# EAGLE design New (EAGLE 8.6.0)
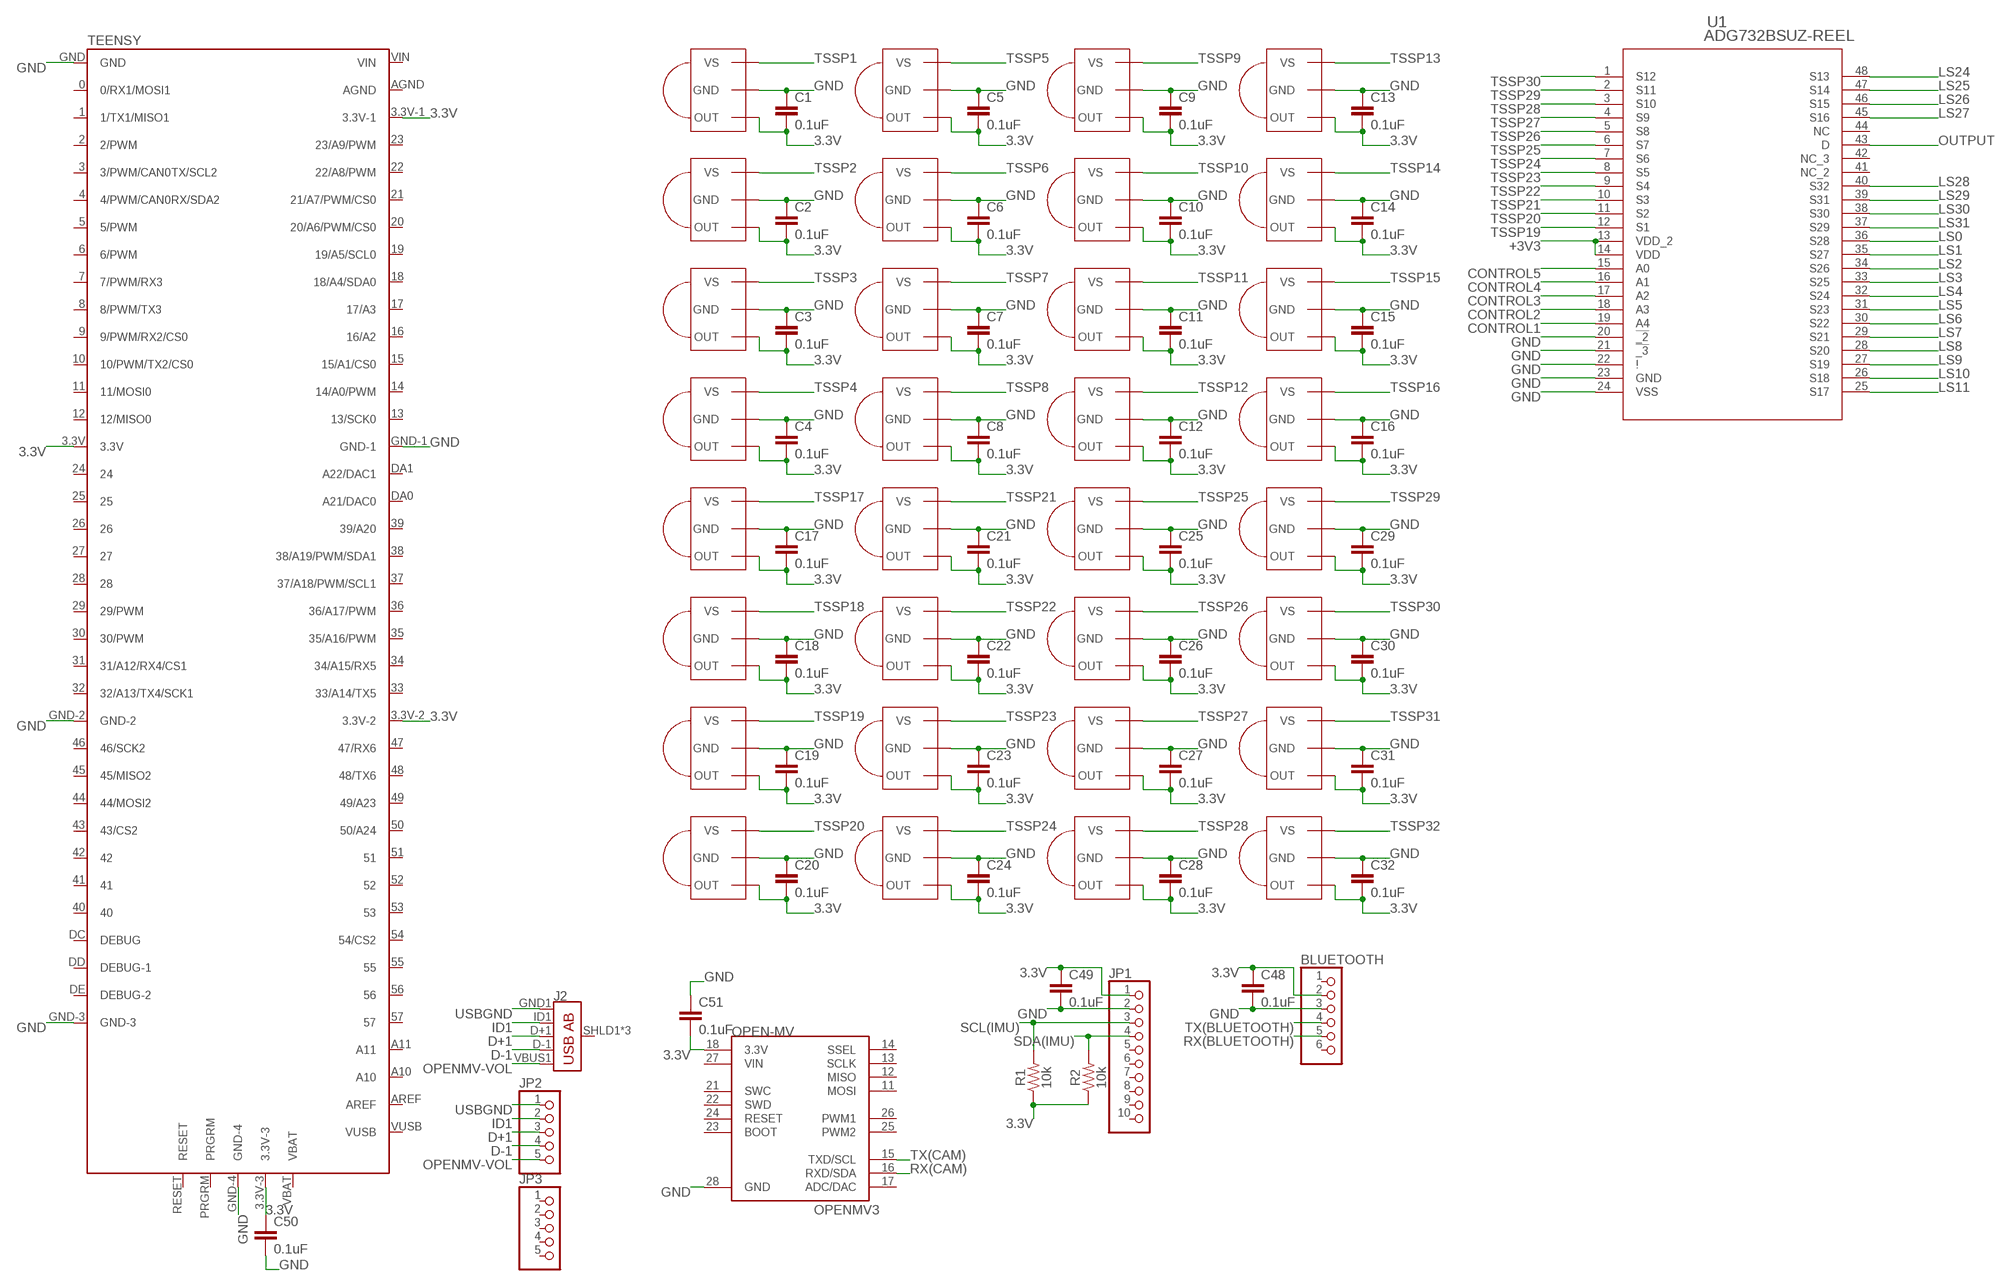
[diagram p0: schematic, sheet 1, part 1 of 2]
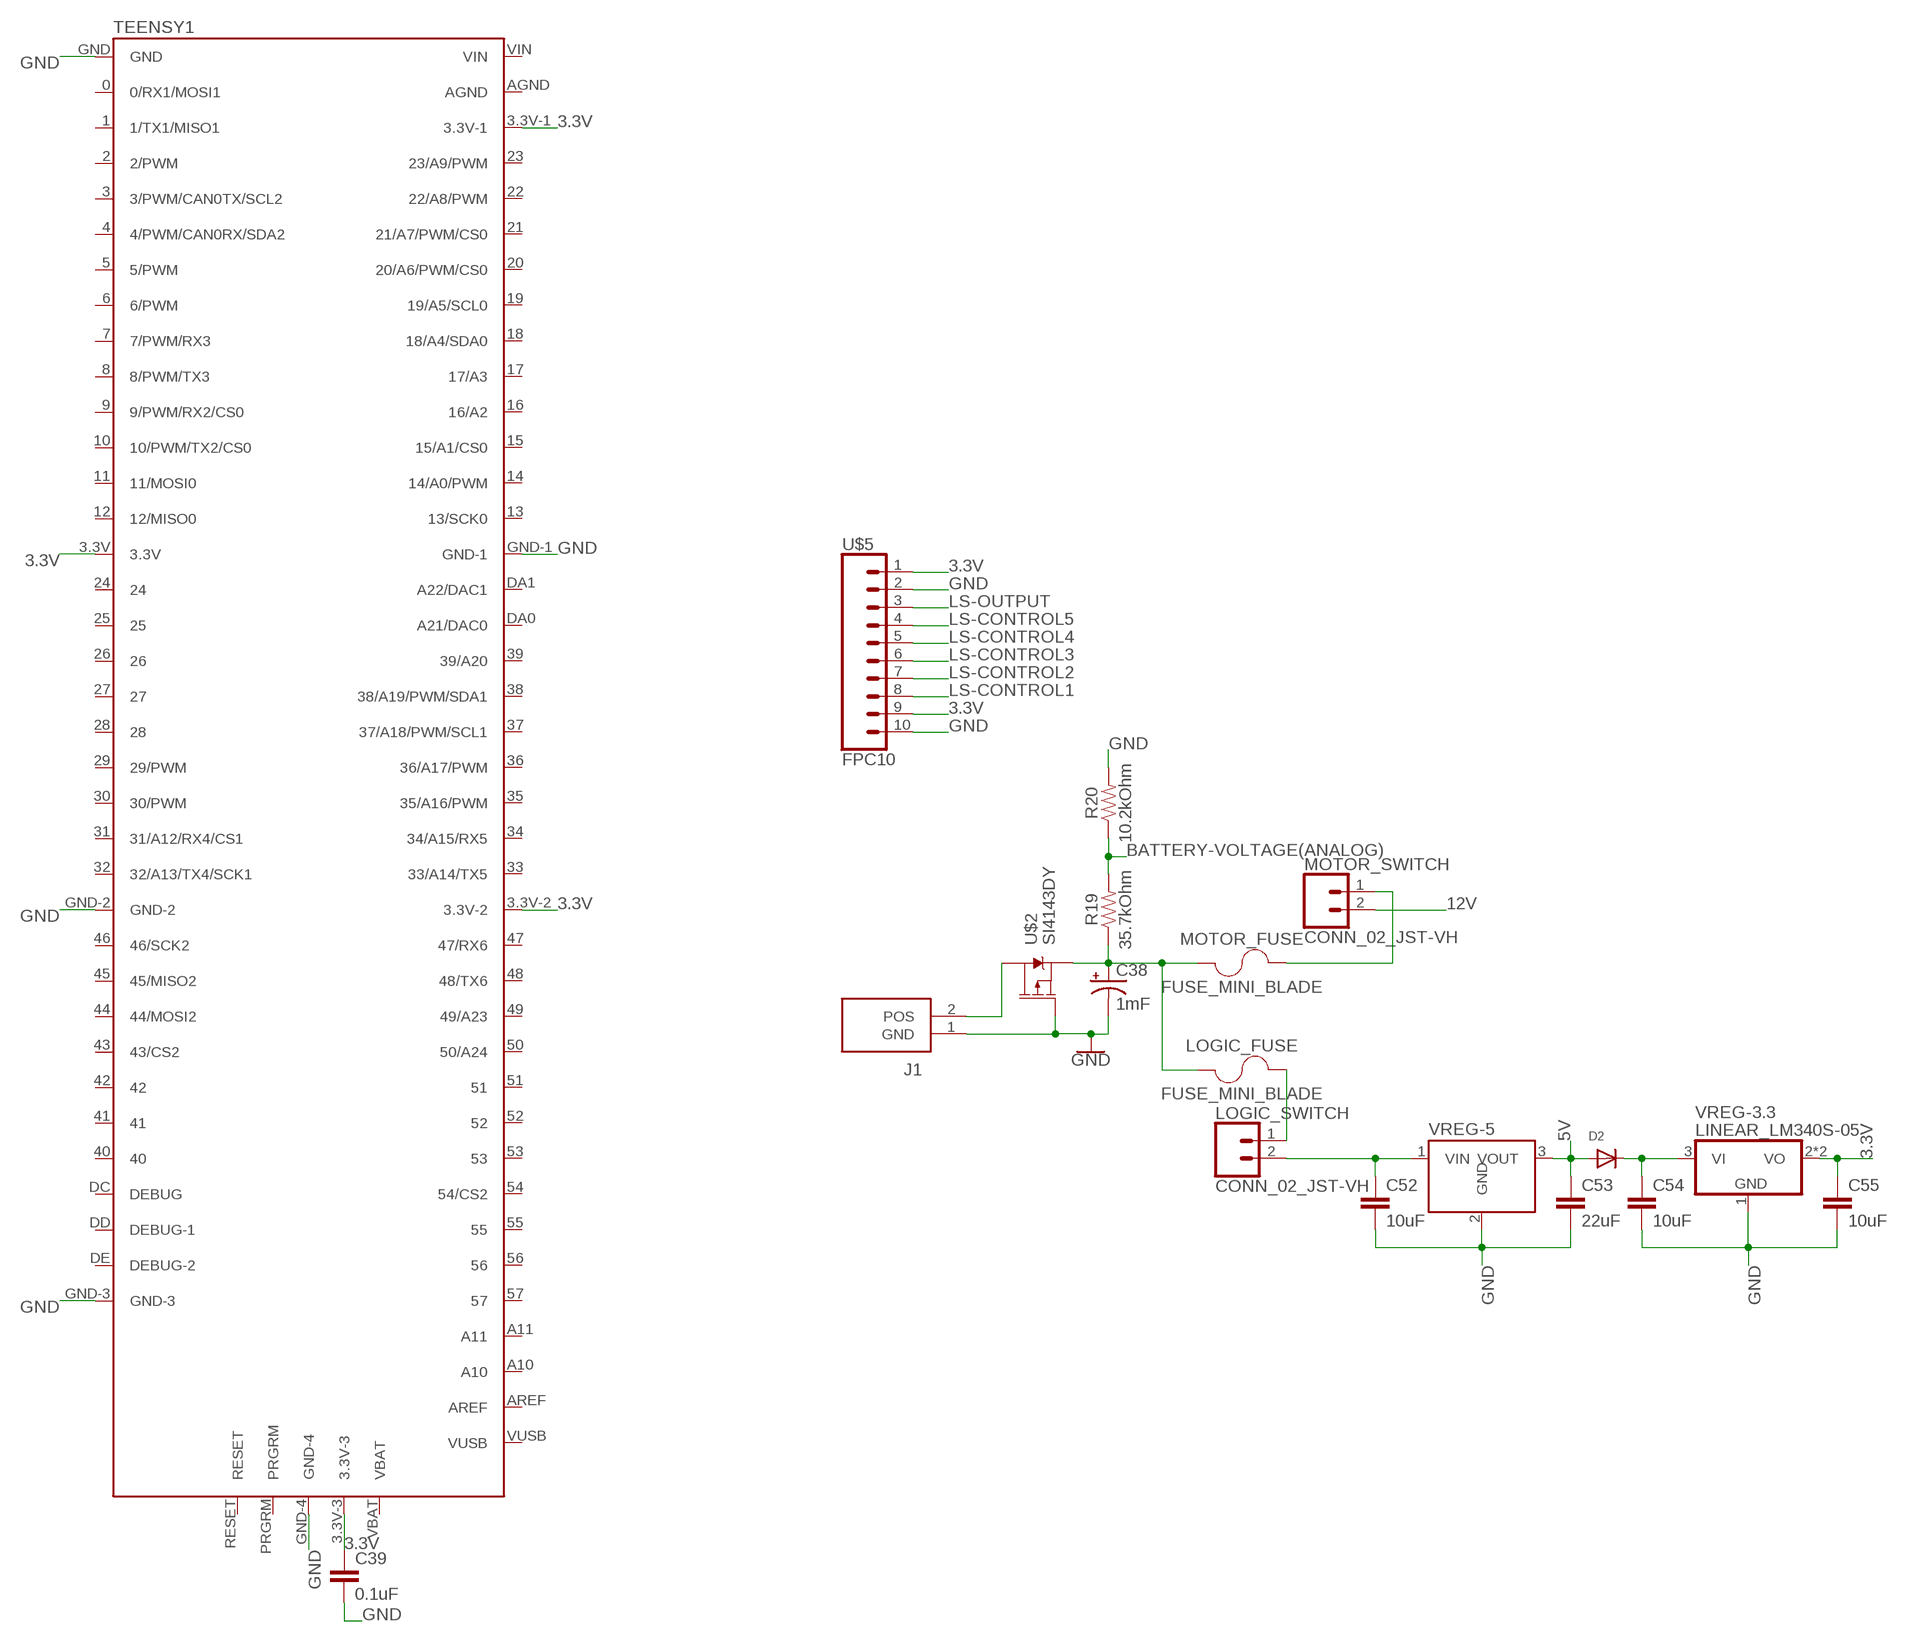
[diagram p1: schematic, sheet 1, part 2 of 2]

## Parts
BLUETOOTH  PINHD-1X6  [1X06]
C1  0.1uF  0.1UF-0603-25V-(+80/-20%)  [0603]
C2  0.1uF  0.1UF-0603-25V-(+80/-20%)  [0603]
C3  0.1uF  0.1UF-0603-25V-(+80/-20%)  [0603]
C4  0.1uF  0.1UF-0603-25V-(+80/-20%)  [0603]
C5  0.1uF  0.1UF-0603-25V-(+80/-20%)  [0603]
C6  0.1uF  0.1UF-0603-25V-(+80/-20%)  [0603]
C7  0.1uF  0.1UF-0603-25V-(+80/-20%)  [0603]
C8  0.1uF  0.1UF-0603-25V-(+80/-20%)  [0603]
C9  0.1uF  0.1UF-0603-25V-(+80/-20%)  [0603]
C10  0.1uF  0.1UF-0603-25V-(+80/-20%)  [0603]
C11  0.1uF  0.1UF-0603-25V-(+80/-20%)  [0603]
C12  0.1uF  0.1UF-0603-25V-(+80/-20%)  [0603]
C13  0.1uF  0.1UF-0603-25V-(+80/-20%)  [0603]
C14  0.1uF  0.1UF-0603-25V-(+80/-20%)  [0603]
C15  0.1uF  0.1UF-0603-25V-(+80/-20%)  [0603]
C16  0.1uF  0.1UF-0603-25V-(+80/-20%)  [0603]
C17  0.1uF  0.1UF-0603-25V-(+80/-20%)  [0603]
C18  0.1uF  0.1UF-0603-25V-(+80/-20%)  [0603]
C19  0.1uF  0.1UF-0603-25V-(+80/-20%)  [0603]
C20  0.1uF  0.1UF-0603-25V-(+80/-20%)  [0603]
C21  0.1uF  0.1UF-0603-25V-(+80/-20%)  [0603]
C22  0.1uF  0.1UF-0603-25V-(+80/-20%)  [0603]
C23  0.1uF  0.1UF-0603-25V-(+80/-20%)  [0603]
C24  0.1uF  0.1UF-0603-25V-(+80/-20%)  [0603]
C25  0.1uF  0.1UF-0603-25V-(+80/-20%)  [0603]
C26  0.1uF  0.1UF-0603-25V-(+80/-20%)  [0603]
C27  0.1uF  0.1UF-0603-25V-(+80/-20%)  [0603]
C28  0.1uF  0.1UF-0603-25V-(+80/-20%)  [0603]
C29  0.1uF  0.1UF-0603-25V-(+80/-20%)  [0603]
C30  0.1uF  0.1UF-0603-25V-(+80/-20%)  [0603]
C31  0.1uF  0.1UF-0603-25V-(+80/-20%)  [0603]
C32  0.1uF  0.1UF-0603-25V-(+80/-20%)  [0603]
C38  1mF  1000UF-RADIAL-5MM-25V-20%  [CPOL-RADIAL-5MM-10MM]
C39  0.1uF  0.1UF-0603-25V-(+80/-20%)  [0603]
C48  0.1uF  0.1UF-0603-25V-(+80/-20%)  [0603]
C49  0.1uF  0.1UF-0603-25V-(+80/-20%)  [0603]
C50  0.1uF  0.1UF-0603-25V-(+80/-20%)  [0603]
C51  0.1uF  0.1UF-0603-25V-(+80/-20%)  [0603]
C52  10uF  0805_CAPACITOR_SMD  [SPARKFUN-CAPACITORS_0805]
C53  22uF  1206_CAPACITOR_SMD  [SPARKFUN-CAPACITORS_1206]
C54  10uF  0805_CAPACITOR_SMD  [SPARKFUN-CAPACITORS_0805]
C55  10uF  0805_CAPACITOR_SMD  [SPARKFUN-CAPACITORS_0805]
D2  ADAFRUIT_DIODE_SOD-123FL:1  [ADAFRUIT_SOD-123FL]
J1  PRT-10474  [SHDR2W320P716_1X2_1574X813X158]
J2  USB_AB_SMT  [USB-AB-MICRO-SMD]
JP1  PINHD-1X10  [1X10]
JP2  PINHD-1X5  [1X05]
JP3  PINHD-1X5  [1X05]
LOGIC_FUSE  FUSE_MINI_BLADE  [SL-1538]
LOGIC_SWITCH  CONN_02_JST-VH  [B2P-VH@1]
MOTOR_FUSE  FUSE_MINI_BLADE  [SL-1538]
MOTOR_SWITCH  CONN_02_JST-VH  [B2P-VH@1]
OPEN-MV  OPENMV3  [OPENMV3]
R1  10k  10KOHM-0603-1/10W-1%  [0603]
R2  10k  10KOHM-0603-1/10W-1%  [0603]
R19  35.7kOhm  75KOHM-0603-1/10W-1%  [0603]
R20  10.2kOhm  75KOHM-0603-1/10W-1%  [0603]
TEENSY  TEENSY-3.5  [TEENSY-3.5]
TEENSY1  TEENSY-3.5  [TEENSY-3.5]
TSSP1  TSSP58038  [MINICAST]
TSSP2  TSSP58038  [MINICAST]
TSSP3  TSSP58038  [MINICAST]
TSSP4  TSSP58038  [MINICAST]
TSSP5  TSSP58038  [MINICAST]
TSSP6  TSSP58038  [MINICAST]
TSSP7  TSSP58038  [MINICAST]
TSSP8  TSSP58038  [MINICAST]
TSSP9  TSSP58038  [MINICAST]
TSSP10  TSSP58038  [MINICAST]
TSSP11  TSSP58038  [MINICAST]
TSSP12  TSSP58038  [MINICAST]
TSSP13  TSSP58038  [MINICAST]
TSSP14  TSSP58038  [MINICAST]
TSSP15  TSSP58038  [MINICAST]
TSSP16  TSSP58038  [MINICAST]
TSSP17  TSSP58038  [MINICAST]
TSSP18  TSSP58038  [MINICAST]
TSSP19  TSSP58038  [MINICAST]
TSSP20  TSSP58038  [MINICAST]
TSSP21  TSSP58038  [MINICAST]
TSSP22  TSSP58038  [MINICAST]
TSSP23  TSSP58038  [MINICAST]
TSSP24  TSSP58038  [MINICAST]
TSSP25  TSSP58038  [MINICAST]
TSSP26  TSSP58038  [MINICAST]
TSSP27  TSSP58038  [MINICAST]
TSSP28  TSSP58038  [MINICAST]
TSSP29  TSSP58038  [MINICAST]
TSSP30  TSSP58038  [MINICAST]
TSSP31  TSSP58038  [MINICAST]
TSSP32  TSSP58038  [MINICAST]
U1  ADG732BSUZ-REEL  [SU_48]
U$2  SI4143DY  [SO-8]
U$5  FPC10  [FPC10]
VREG-3.3  LINEAR_LM340S-05  [LINEAR_TO263-3]
VREG-5  V78-2000-SWITCHING-REGULATOR_V78-2000  [V78-2000-SWITCHING-REGULATOR_V78-2000]

## Nets
3.3V: BLUETOOTH.2 C1.2 C2.2 C3.2 C4.2 C5.2 C6.2 C7.2 C8.2 C9.2 C10.2 C11.2 C12.2 C13.2 C14.2 C15.2 C16.2 C17.2 C18.2 C19.2 C20.2 C21.2 C22.2 C23.2 C24.2 C25.2 C26.2 C27.2 C28.2 C29.2 C30.2 C31.2 C32.2 C39.1 C48.1 C49.1 C50.1 C51.2 C55.1 JP1.1 OPEN-MV.18(3.3V) R1.1 R2.1 TEENSY1.3.3V TEENSY1.3.3V-1 TEENSY1.3.3V-2 TEENSY1.3.3V-3 TEENSY.3.3V TEENSY.3.3V-1 TEENSY.3.3V-2 TEENSY.3.3V-3 TSSP1.1(OUT) TSSP2.1(OUT) TSSP3.1(OUT) TSSP4.1(OUT) TSSP5.1(OUT) TSSP6.1(OUT) TSSP7.1(OUT) TSSP8.1(OUT) TSSP9.1(OUT) TSSP10.1(OUT) TSSP11.1(OUT) TSSP12.1(OUT) TSSP13.1(OUT) TSSP14.1(OUT) TSSP15.1(OUT) TSSP16.1(OUT) TSSP17.1(OUT) TSSP18.1(OUT) TSSP19.1(OUT) TSSP20.1(OUT) TSSP21.1(OUT) TSSP22.1(OUT) TSSP23.1(OUT) TSSP24.1(OUT) TSSP25.1(OUT) TSSP26.1(OUT) TSSP27.1(OUT) TSSP28.1(OUT) TSSP29.1(OUT) TSSP30.1(OUT) TSSP31.1(OUT) TSSP32.1(OUT) U$5.1 U$5.9 VREG-3.3.2(VO) VREG-3.3.TAB(VO)
5V: C53.1 D2.A VREG-5.3(VOUT)
12V: MOTOR_SWITCH.2
+3V3: U1.13(VDD_2) U1.14(VDD)
BATTERY-VOLTAGE(ANALOG): R19.2 R20.1
CONTROL1: U1.19(A4)
CONTROL2: U1.18(A3)
CONTROL3: U1.17(A2)
CONTROL4: U1.16(A1)
CONTROL5: U1.15(A0)
D+1: J2.D+1(D+) JP2.3
D-1: J2.D-1(D-) JP2.4
GND: BLUETOOTH.3 C1.1 C2.1 C3.1 C4.1 C5.1 C6.1 C7.1 C8.1 C9.1 C10.1 C11.1 C12.1 C13.1 C14.1 C15.1 C16.1 C17.1 C18.1 C19.1 C20.1 C21.1 C22.1 C23.1 C24.1 C25.1 C26.1 C27.1 C28.1 C29.1 C30.1 C31.1 C32.1 C38.- C39.2 C48.2 C49.2 C50.2 C51.1 C52.2 C53.2 C54.2 C55.2 J1.1(GND) JP1.2 OPEN-MV.28(GND) R20.2 TEENSY1.GND TEENSY1.GND-1 TEENSY1.GND-2 TEENSY1.GND-3 TEENSY1.GND-4 TEENSY.GND TEENSY.GND-1 TEENSY.GND-2 TEENSY.GND-3 TEENSY.GND-4 TSSP1.2(GND) TSSP2.2(GND) TSSP3.2(GND) TSSP4.2(GND) TSSP5.2(GND) TSSP6.2(GND) TSSP7.2(GND) TSSP8.2(GND) TSSP9.2(GND) TSSP10.2(GND) TSSP11.2(GND) TSSP12.2(GND) TSSP13.2(GND) TSSP14.2(GND) TSSP15.2(GND) TSSP16.2(GND) TSSP17.2(GND) TSSP18.2(GND) TSSP19.2(GND) TSSP20.2(GND) TSSP21.2(GND) TSSP22.2(GND) TSSP23.2(GND) TSSP24.2(GND) TSSP25.2(GND) TSSP26.2(GND) TSSP27.2(GND) TSSP28.2(GND) TSSP29.2(GND) TSSP30.2(GND) TSSP31.2(GND) TSSP32.2(GND) U1.20(!_2) U1.21(!_3) U1.22(!) U1.23(GND) U1.24(VSS) U$2.4(G) U$5.2 U$5.10 VREG-3.3.1(GND) VREG-5.2(GND)
ID1: J2.ID1(USBID) JP2.2
LS0: U1.36(S28)
LS1: U1.35(S27)
LS2: U1.34(S26)
LS3: U1.33(S25)
LS4: U1.32(S24)
LS5: U1.31(S23)
LS6: U1.30(S22)
LS7: U1.29(S21)
LS8: U1.28(S20)
LS9: U1.27(S19)
LS10: U1.26(S18)
LS11: U1.25(S17)
LS24: U1.48(S13)
LS25: U1.47(S14)
LS26: U1.46(S15)
LS27: U1.45(S16)
LS28: U1.40(S32)
LS29: U1.39(S31)
LS30: U1.38(S30)
LS31: U1.37(S29)
LS-CONTROL1: U$5.8
LS-CONTROL2: U$5.7
LS-CONTROL3: U$5.6
LS-CONTROL4: U$5.5
LS-CONTROL5: U$5.4
LS-OUTPUT: U$5.3
N$1: J1.2(POS) U$2.5(D) U$2.6(D) U$2.7(D) U$2.8(D)
N$2: MOTOR_FUSE.P$2 MOTOR_SWITCH.1
N$3: C38.+ LOGIC_FUSE.P$1 MOTOR_FUSE.P$1 R19.1 U$2.1(S) U$2.2(S) U$2.3(S)
N$4: LOGIC_FUSE.P$2 LOGIC_SWITCH.1
N$40: C52.1 LOGIC_SWITCH.2 VREG-5.1(VIN)
N$41: C54.1 D2.C VREG-3.3.3(VI)
OPENMV-VOL: J2.VBUS1(VBUS) JP2.5
OUTPUT: U1.43(D)
RX(BLUETOOTH): BLUETOOTH.5
RX(CAM): OPEN-MV.16(RXD/SDA)
SCL(IMU): JP1.3 R1.2
SDA(IMU): JP1.4 R2.2
TSSP1: TSSP1.3(VS)
TSSP2: TSSP2.3(VS)
TSSP3: TSSP3.3(VS)
TSSP4: TSSP4.3(VS)
TSSP5: TSSP5.3(VS)
TSSP6: TSSP6.3(VS)
TSSP7: TSSP7.3(VS)
TSSP8: TSSP8.3(VS)
TSSP9: TSSP9.3(VS)
TSSP10: TSSP10.3(VS)
TSSP11: TSSP11.3(VS)
TSSP12: TSSP12.3(VS)
TSSP13: TSSP13.3(VS)
TSSP14: TSSP14.3(VS)
TSSP15: TSSP15.3(VS)
TSSP16: TSSP16.3(VS)
TSSP17: TSSP17.3(VS)
TSSP18: TSSP18.3(VS)
TSSP19: TSSP19.3(VS) U1.12(S1)
TSSP20: TSSP20.3(VS) U1.11(S2)
TSSP21: TSSP21.3(VS) U1.10(S3)
TSSP22: TSSP22.3(VS) U1.9(S4)
TSSP23: TSSP23.3(VS) U1.8(S5)
TSSP24: TSSP24.3(VS) U1.7(S6)
TSSP25: TSSP25.3(VS) U1.6(S7)
TSSP26: TSSP26.3(VS) U1.5(S8)
TSSP27: TSSP27.3(VS) U1.4(S9)
TSSP28: TSSP28.3(VS) U1.3(S10)
TSSP29: TSSP29.3(VS) U1.2(S11)
TSSP30: TSSP30.3(VS) U1.1(S12)
TSSP31: TSSP31.3(VS)
TSSP32: TSSP32.3(VS)
TX(BLUETOOTH): BLUETOOTH.4
TX(CAM): OPEN-MV.15(TXD/SCL)
USBGND: J2.GND1(GND) JP2.1
Unconnected: BLUETOOTH.1 BLUETOOTH.6 J2.SHLD1(SHIELD) J2.SHLD2(SHIELD) J2.SHLD3(SHIELD) JP1.5 JP1.6 JP1.7 JP1.8 JP1.9 JP1.10 JP3.1 JP3.2 JP3.3 JP3.4 JP3.5 OPEN-MV.11(MOSI) OPEN-MV.12(MISO) OPEN-MV.13(SCLK) OPEN-MV.14(SSEL) OPEN-MV.17(ADC/DAC) OPEN-MV.21(SWC) OPEN-MV.22(SWD) OPEN-MV.23(BOOT) OPEN-MV.24(RESET) OPEN-MV.25(PWM2) OPEN-MV.26(PWM1) TEENSY1.0(0/RX1/MOSI1) TEENSY1.1(1/TX1/MISO1) TEENSY1.2(2/PWM) TEENSY1.3(3/PWM/CAN0TX/SCL2) TEENSY1.4(4/PWM/CAN0RX/SDA2) TEENSY1.5(5/PWM) TEENSY1.6(6/PWM) TEENSY1.7(7/PWM/RX3) TEENSY1.8(8/PWM/TX3) TEENSY1.9(9/PWM/RX2/CS0) TEENSY1.10(10/PWM/TX2/CS0) TEENSY1.11(11/MOSI0) TEENSY1.12(12/MISO0) TEENSY1.13(13/SCK0) TEENSY1.14(14/A0/PWM) TEENSY1.15(15/A1/CS0) TEENSY1.16(16/A2) TEENSY1.17(17/A3) TEENSY1.18(18/A4/SDA0) TEENSY1.19(19/A5/SCL0) TEENSY1.20(20/A6/PWM/CS0) TEENSY1.21(21/A7/PWM/CS0) TEENSY1.22(22/A8/PWM) TEENSY1.23(23/A9/PWM) TEENSY1.24 TEENSY1.25 TEENSY1.26 TEENSY1.27 TEENSY1.28 TEENSY1.29(29/PWM) TEENSY1.30(30/PWM) TEENSY1.31(31/A12/RX4/CS1) TEENSY1.32(32/A13/TX4/SCK1) TEENSY1.33(33/A14/TX5) TEENSY1.34(34/A15/RX5) TEENSY1.35(35/A16/PWM) TEENSY1.36(36/A17/PWM) TEENSY1.37(37/A18/PWM/SCL1) TEENSY1.38(38/A19/PWM/SDA1) TEENSY1.39(39/A20) TEENSY1.40 TEENSY1.41 TEENSY1.42 TEENSY1.43(43/CS2) TEENSY1.44(44/MOSI2) TEENSY1.45(45/MISO2) TEENSY1.46(46/SCK2) TEENSY1.47(47/RX6) TEENSY1.48(48/TX6) TEENSY1.49(49/A23) TEENSY1.50(50/A24) TEENSY1.51 TEENSY1.52 TEENSY1.53 TEENSY1.54(54/CS2) TEENSY1.55 TEENSY1.56 TEENSY1.57 TEENSY1.A10 TEENSY1.A11 TEENSY1.AGND TEENSY1.AREF TEENSY1.DA0(A21/DAC0) TEENSY1.DA1(A22/DAC1) TEENSY1.DC(DEBUG) TEENSY1.DD(DEBUG-1) TEENSY1.DE(DEBUG-2) TEENSY1.PRGRM TEENSY1.RESET TEENSY1.VBAT TEENSY1.VIN TEENSY1.VUSB TEENSY.0(0/RX1/MOSI1) TEENSY.1(1/TX1/MISO1) TEENSY.2(2/PWM) TEENSY.3(3/PWM/CAN0TX/SCL2) TEENSY.4(4/PWM/CAN0RX/SDA2) TEENSY.5(5/PWM) TEENSY.6(6/PWM) TEENSY.7(7/PWM/RX3) TEENSY.8(8/PWM/TX3) TEENSY.9(9/PWM/RX2/CS0) TEENSY.10(10/PWM/TX2/CS0) TEENSY.11(11/MOSI0) TEENSY.12(12/MISO0) TEENSY.13(13/SCK0) TEENSY.14(14/A0/PWM) TEENSY.15(15/A1/CS0) TEENSY.16(16/A2) TEENSY.17(17/A3) TEENSY.18(18/A4/SDA0) TEENSY.19(19/A5/SCL0) TEENSY.20(20/A6/PWM/CS0) TEENSY.21(21/A7/PWM/CS0) TEENSY.22(22/A8/PWM) TEENSY.23(23/A9/PWM) TEENSY.24 TEENSY.25 TEENSY.26 TEENSY.27 TEENSY.28 TEENSY.29(29/PWM) TEENSY.30(30/PWM) TEENSY.31(31/A12/RX4/CS1) TEENSY.32(32/A13/TX4/SCK1) TEENSY.33(33/A14/TX5) TEENSY.34(34/A15/RX5) TEENSY.35(35/A16/PWM) TEENSY.36(36/A17/PWM) TEENSY.37(37/A18/PWM/SCL1) TEENSY.38(38/A19/PWM/SDA1) TEENSY.39(39/A20) TEENSY.40 TEENSY.41 TEENSY.42 TEENSY.43(43/CS2) TEENSY.44(44/MOSI2) TEENSY.45(45/MISO2) TEENSY.46(46/SCK2) TEENSY.47(47/RX6) TEENSY.48(48/TX6) TEENSY.49(49/A23) TEENSY.50(50/A24) TEENSY.51 TEENSY.52 TEENSY.53 TEENSY.54(54/CS2) TEENSY.55 TEENSY.56 TEENSY.57 TEENSY.A10 TEENSY.A11 TEENSY.AGND TEENSY.AREF TEENSY.DA0(A21/DAC0) TEENSY.DA1(A22/DAC1) TEENSY.DC(DEBUG) TEENSY.DD(DEBUG-1) TEENSY.DE(DEBUG-2) TEENSY.PRGRM TEENSY.RESET TEENSY.VBAT TEENSY.VIN TEENSY.VUSB U1.41(NC_2) U1.42(NC_3) U1.44(NC)

## Power pins joined to a net without a drawn wire
VIN: OPEN-MV.27(VIN)

## Library data of the parts
BLUETOOTH = PinHead+:PINHD-1X6: PIN HEADER
C1-C32 C39 C48-C51 = SparkFun-Capacitors:0.1UF: 0.1µF ceramic capacitors A capacitor is a passive two-terminal electrical component used to store electrical energy temporarily in an electric field.; PROD_ID: CAP-00810
C38 = SparkFun-Capacitors:1000UF: 1,000µF/1mF ceramic capacitors A capacitor is a passive two-terminal electrical component used to store electrical energy temporarily in an electric field. CAP-08070; PROD_ID: CAP-09538
C52 C54 C55 = Capacitors:0805_CAPACITOR_SMD
C53 = Capacitors:1206_CAPACITOR_SMD
D2 = Main:ADAFRUIT_DIODE*?:1: Diode SMADIODE - SMA Surface Mount Package 20V 1A Schottky Diode Digikey: 641-1014-6-ND DO-1N4148 - Through Hole Small Current Diode SOD-123 20V 1 A (.5mV Vf) Schottky Diode - Digikey: MBRX120TPMSCT-ND SOD-323 10V 570mA (.38mV Vf, 3ns) Schottky Diode - Digikey: ZLLS410CT-ND SOD-523 30V 30mA Schottky Diode (RB751S-40TE61) - Digikey: RB751S-40TE61CT-ND SOT23-R/W - SOT23 Package (R = Solder Paste/Reflow Ovens, W = Hand-Soldering) BAT54Film 40V 300mA - Digikey: 497-7162-1-ND
J1 = XT60:PRT-10474: Soldering Workstation Equipment XT60 Connectors Male/Female Pair Source: Datasheet <http://cdn.sparkfun.com/datasheets/Prototyping/xt60.pdf>; ARROW_PART_NUMBER: PRT-10474; DESCRIPTION: Soldering Workstation Equipment XT60 Connectors Male/Female Pair; HEIGHT: 15.875mm; MANUFACTURER_NAME: SparkFun; MANUFACTURER_PART_NUMBER: PRT-10474
J2 = SparkFun-Connectors:USB_AB: USB Type AB Micro Connector OTG-compatible. 5 pins, 3 shield pins SparkFun Products: IOIO-OTG <https://www.sparkfun.com/products/13613> SparkFun SAMD21 Mini Breakout <https://www.sparkfun.com/products/13664>; PROD_ID: CONN-11794
JP1 = PinHead+:PINHD-1X10: PIN HEADER
JP2 JP3 = pinhead:PINHD-1X5: PIN HEADER
LOGIC_FUSE MOTOR_FUSE = Fuse_Holder:FUSE_MINI_BLADE: SL-1538 Aliexpress <https://www.aliexpress.com/item/SL-1538-MINI-Style-Blade-Fuse-Holers-PCB-Mount-Fuse-holders-0153008/503553051.html>
LOGIC_SWITCH MOTOR_SWITCH = JST-VH:CONN_02_JST-VH: B2P-VH(LF)(SN) Digikey <https://www.digikey.com.au/product-detail/en/jst-sales-america-inc/B2P-VH-LF-SN/455-1639-ND/926547>
OPEN-MV = OpenMV:OPENMV3
R1 R2 = SparkFun-Resistors:10KOHM: 10kΩ resistor A resistor is a passive two-terminal electrical component that implements electrical resistance as a circuit element. Resistors act to reduce current flow, and, at the same time, act to lower voltage levels within circuits. - Wikipedia; PROD_ID: RES-00824
R19 R20 = SparkFun-Resistors:75KOHM: 75Ω resistor A resistor is a passive two-terminal electrical component that implements electrical resistance as a circuit element. Resistors act to reduce current flow, and, at the same time, act to lower voltage levels within circuits. - Wikipedia; PROD_ID: RES-09737; VALUE: 75
TEENSY TEENSY1 = teensy-3.5:TEENSY-3.5
TSSP1-TSSP32 = IR Receivers:TSSP58038: IR Receiver Module for Light Barrier Systems datasheet <http://www.vishay.com/docs/82479/tssp58038.pdf>
U1 = ADG732:ADG732BSUZ-REEL; MANUFACTURER_PART_NUMBER: ADG732BSUZREEL; VENDOR: Analog Devices Inc
U$2 = MOSFET:SI4143DY: MOSFET P-CHANNEL 30V 25.3A 8SO Digikey <https://www.digikey.com.au/product-detail/en/vishay-siliconix/SI4143DY-T1-GE3/SI4143DY-T1-GE3CT-ND/6834487>
U$5 = FFC:FPC10
VREG-3.3 = Main:LINEAR_LM340?-*: Positive VOLTAGE REGULATOR Source: http://cache.national.com/ds/LM/LM340.pdf
VREG-5 = Main:V78-2000-SWITCHING-REGULATOR_V78-2000

## Board
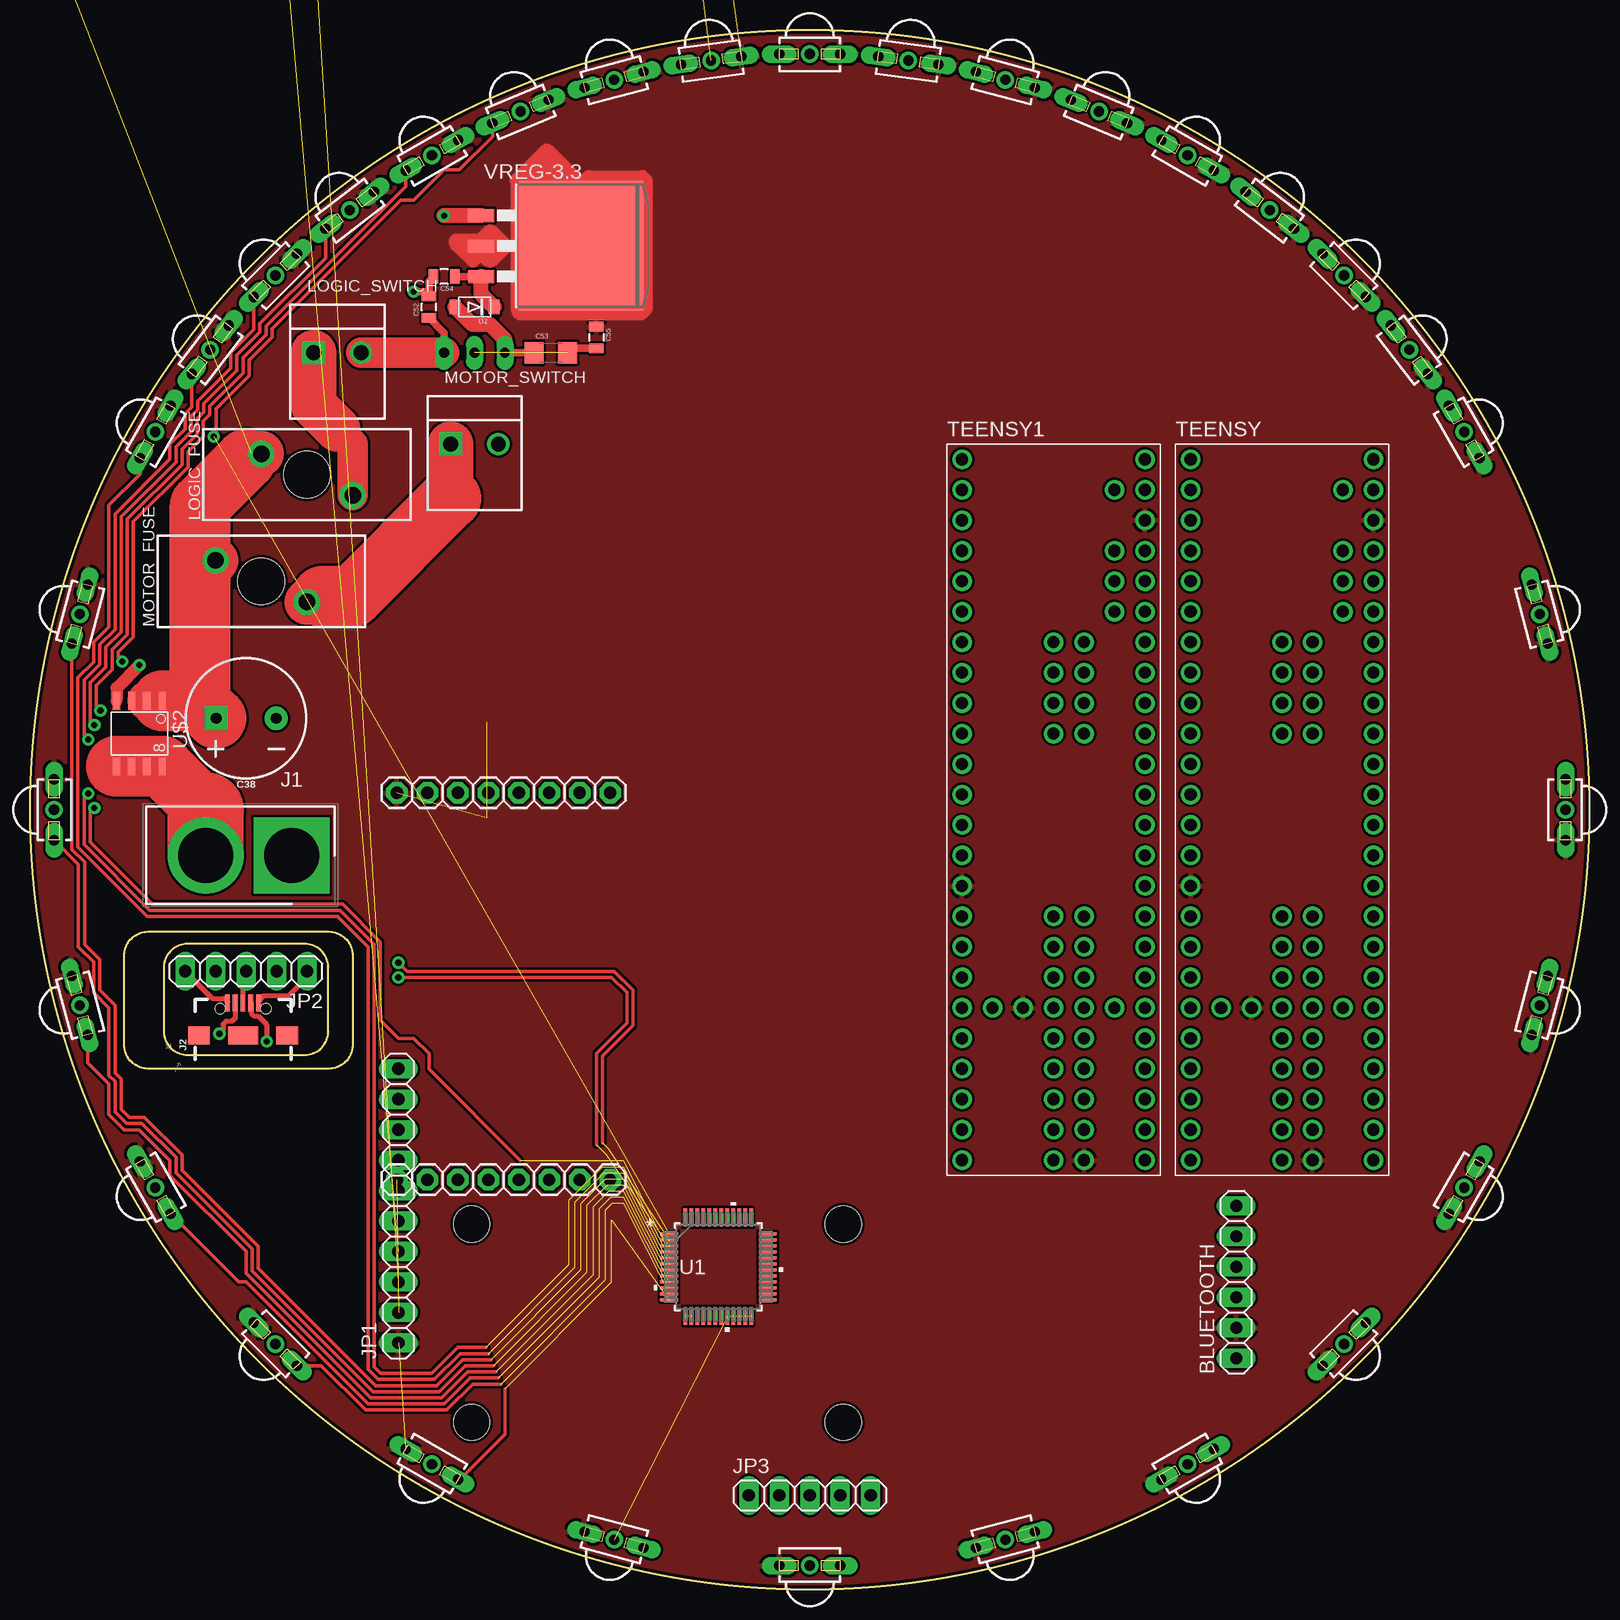
[diagram p2: board, top side]
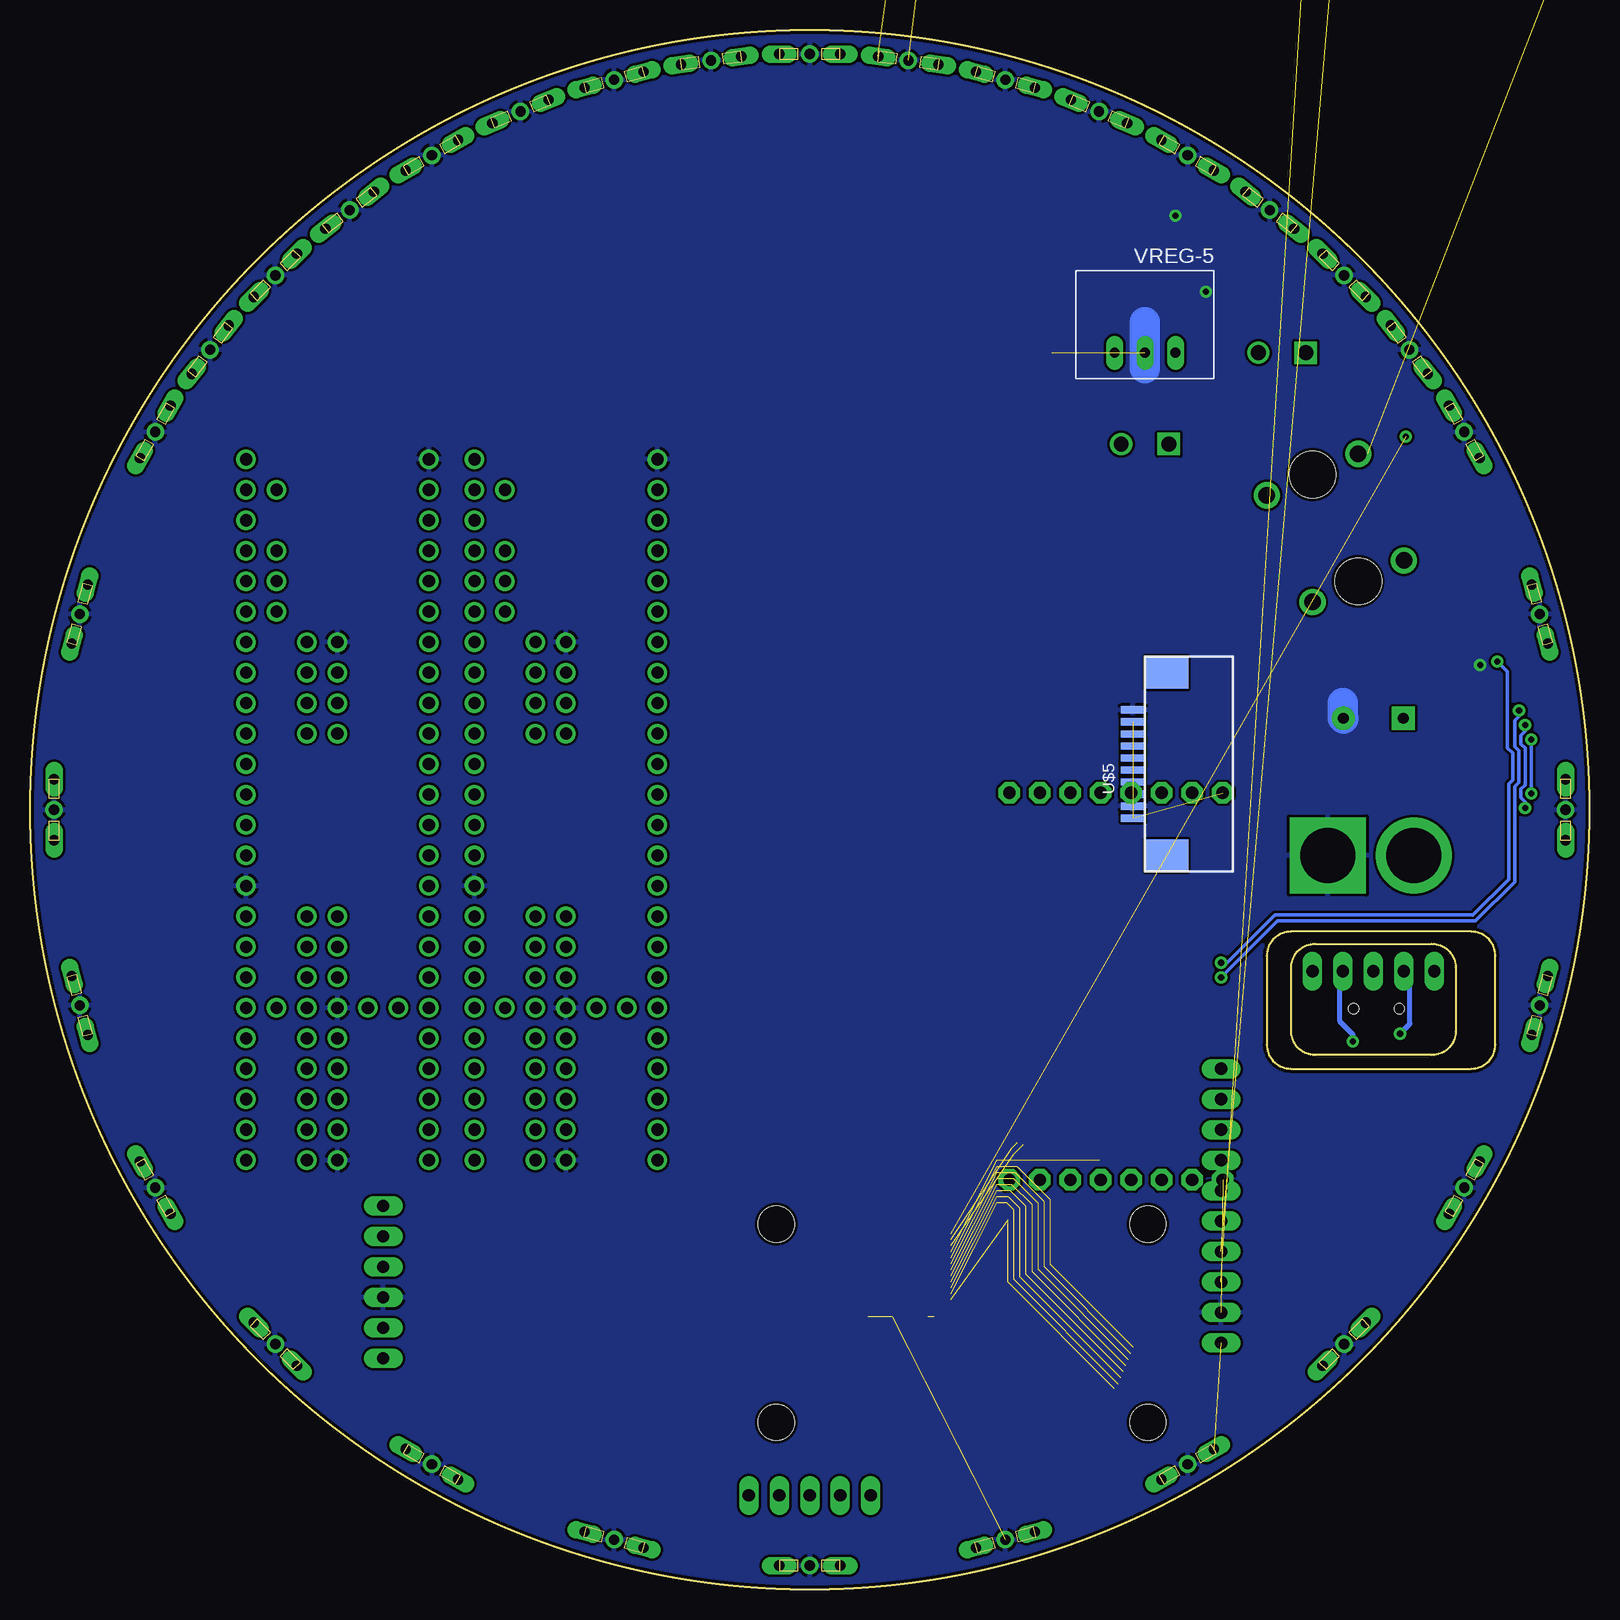
[diagram p3: board, bottom side, seen from below]

Size 130 x 130 mm. Coordinates in mm from the lower left corner, seen from the top.
Outline: 9.85,54.84 24.9,54.84 arc-90 26.9,52.84 26.9,45.41 arc-90 24.9,43.41 9.85,43.41 arc-90 7.85,45.41 7.85,52.84 arc-90 9.85,54.84
Outline: 11.15,51.82 11.15,46.55 arc90 13.15,44.55 22.87,44.55 arc90 24.87,46.55 24.87,51.82 arc90 22.87,53.82 13.15,53.82 arc90 11.15,51.82
Outline: circle at 65,65 radius 65
Copper layers (1*16): Top 0.035mm / dielectric 1.5mm / Bottom 0.035mm
Design rules "SparkFun": minimum track width 8mil, minimum drill 20mil, track to track 8mil, track to pad 8mil, pad to pad 8mil, via to via 8mil, smd to smd 8mil, copper to edge 10mil, drill to drill 8mil, minimum pad ring 12mil, minimum via ring 10mil, stop-mask expansion 4mil, vias tented up to drill 25mil, thermal gap 10mil
Holes 3 mm at 36.81,30.46 67.79,30.46 67.79,13.95 36.81,13.95

### Footprints (pad centres in the part's own frame; a part is rotated, then mirrored left to right if it is on the bottom)
1X06 = drill 1.016 long: 1 -6.35,0; 2 -3.81,0; 3 -1.27,0; 4 1.27,0; 5 3.81,0; 6 6.35,0
0603 = smd 1.1 x 1: 1 -0.85,0; 2 0.85,0
CPOL-RADIAL-5MM-10MM = drill 0.9 pad 1.93 square: + 2.5,0 | drill 0.9 pad 1.93: - -2.5,0
SPARKFUN-CAPACITORS_0805 = smd 0.8 x 1.2: 1 -0.9,0; 2 0.9,0
SPARKFUN-CAPACITORS_1206 = smd 1.6 x 1.8: 1 -1.4,0; 2 1.4,0
ADAFRUIT_SOD-123FL = smd 0.91 x 1.22: A 1.637,0; C -1.637,0
SHDR2W320P716_1X2_1574X813X158 = drill 4.572 pad 6.35 square: 1 0,0 | drill 4.572 pad 6.35: 2 7.163,0
USB-AB-MICRO-SMD = smd 1.4 x 0.4: D+1 2.7,0; D-1 2.7,0.65; GND1 2.7,-1.3; ID1 2.7,-0.65; VBUS1 2.7,1.3 | smd 1.5 x 1.8: SHLD1 0,-3.68; SHLD2 0,3.68 | smd 1.5 x 2.5: SHLD3 0,0 | hole 0.85: 2.2,1.9; 2.2,-1.9
1X10 = drill 1.016 long: 1 -11.43,0; 2 -8.89,0; 3 -6.35,0; 4 -3.81,0; 5 -1.27,0; 6 1.27,0; 7 3.81,0; 8 6.35,0; 9 8.89,0; 10 11.43,0
1X05 = drill 1.016 long: 1 -5.08,0; 2 -2.54,0; 3 0,0; 4 2.54,0; 5 5.08,0
SL-1538 = drill 1.37 pad 2.184: P$1 1.73,3.81; P$2 -1.73,-3.81 | hole 3.88: 0,0
B2P-VH@1 = drill 1.25 square: 1 -1.98,0 | drill 1.24: 2 1.98,0
OPENMV3 = drill 1.016 pad 1.778 octagon: 11 1.651,19.304; 12 1.651,16.764; 13 1.651,14.224; 14 1.651,11.684; 15 1.651,9.144; 16 1.651,6.604; 17 1.651,4.064; 18 1.651,1.524; 21 33.909,19.304; 22 33.909,16.764; 23 33.909,14.224; 24 33.909,11.684; 25 33.909,9.144; 26 33.909,6.604; 27 33.909,4.064; 28 33.909,1.524
TEENSY-3.5 = drill 1.016: 0 -7.62,26.67; 1 -7.62,24.13; 2 -7.62,21.59; 3 -7.62,19.05; 3.3V -7.62,-6.35; 3.3V-1 7.62,24.13; 3.3V-2 2.54,-29.21; 3.3V-3 -2.54,-16.51; 4 -7.62,16.51; 5 -7.62,13.97; 6 -7.62,11.43; 7 -7.62,8.89; 8 -7.62,6.35; 9 -7.62,3.81; 10 -7.62,1.27; 11 -7.62,-1.27; 12 -7.62,-3.81; 13 7.62,-3.81; 14 7.62,-1.27; 15 7.62,1.27; 16 7.62,3.81; 17 7.62,6.35; 18 7.62,8.89; 19 7.62,11.43; 20 7.62,13.97; 21 7.62,16.51; 22 7.62,19.05; 23 7.62,21.59; 24 -7.62,-8.89; 25 -7.62,-11.43; 26 -7.62,-13.97; 27 -7.62,-16.51; 28 -7.62,-19.05; 29 -7.62,-21.59; 30 -7.62,-24.13; 31 -7.62,-26.67; 32 -7.62,-29.21; 33 7.62,-29.21; 34 7.62,-26.67; 35 7.62,-24.13; 36 7.62,-21.59; 37 7.62,-19.05; 38 7.62,-16.51; 39 7.62,-13.97; 40 0,-8.89; 41 0,-11.43; 42 0,-13.97; 43 0,-19.05; 44 0,-21.59; 45 0,-24.13; 46 0,-26.67; 47 2.54,-26.67; 48 2.54,-24.13; 49 2.54,-21.59; 50 2.54,-19.05; 51 2.54,-13.97; 52 2.54,-11.43; 53 2.54,-8.89; 54 2.54,6.35; 55 2.54,8.89; 56 2.54,11.43; 57 2.54,13.97; A10 5.08,19.05; A11 5.08,16.51; AGND 7.62,26.67; AREF 5.08,21.59; DA0 7.62,-11.43; DA1 7.62,-8.89; DC 0,8.89; DD 0,6.35; DE 0,11.43; GND -7.62,29.21; GND-1 7.62,-6.35; GND-2 0,-29.21; GND-3 0,-16.51; GND-4 0,13.97; PRGRM 2.54,-16.51; RESET 5.08,-16.51; VBAT -5.08,-16.51; VIN 7.62,29.21; VUSB 5.08,26.67
MINICAST = drill 0.85 long: 1 0,2.54; 3 0,-2.54 | drill 0.85: 2 0,0
SU_48 = smd 1.473 x 0.279: 1 -4.115,2.75; 2 -4.115,2.25; 3 -4.115,1.75; 4 -4.115,1.25; 5 -4.115,0.75; 6 -4.115,0.25; 7 -4.115,-0.25; 8 -4.115,-0.75; 9 -4.115,-1.25; 10 -4.115,-1.75; 11 -4.115,-2.25; 12 -4.115,-2.75; 25 4.115,-2.75; 26 4.115,-2.25; 27 4.115,-1.75; 28 4.115,-1.25; 29 4.115,-0.75; 30 4.115,-0.25; 31 4.115,0.25; 32 4.115,0.75; 33 4.115,1.25; 34 4.115,1.75; 35 4.115,2.25; 36 4.115,2.75 | smd 0.279 x 1.473: 13 -2.75,-4.115; 14 -2.25,-4.115; 15 -1.75,-4.115; 16 -1.25,-4.115; 17 -0.75,-4.115; 18 -0.25,-4.115; 19 0.25,-4.115; 20 0.75,-4.115; 21 1.25,-4.115; 22 1.75,-4.115; 23 2.25,-4.115; 24 2.75,-4.115; 37 2.75,4.115; 38 2.25,4.115; 39 1.75,4.115; 40 1.25,4.115; 41 0.75,4.115; 42 0.25,4.115; 43 -0.25,4.115; 44 -0.75,4.115; 45 -1.25,4.115; 46 -1.75,4.115; 47 -2.25,4.115; 48 -2.75,4.115
SO-8 = smd 1.524 x 0.61: 1 -2.743,1.905; 2 -2.743,0.635; 3 -2.743,-0.635; 4 -2.743,-1.905; 5 2.743,-1.905; 6 2.743,-0.635; 7 2.743,0.635; 8 2.743,1.905
FPC10 = smd 0.61 x 2.007: 1 -4.515,1.003; 2 -3.512,1.003; 3 -2.508,1.003; 4 -1.505,1.003; 5 -0.502,1.003; 6 0.502,1.003; 7 1.505,1.003; 8 2.508,1.003; 9 3.512,1.003; 10 4.515,1.003 | smd 2.667 x 3.607: N/C-1 -7.62,-1.803; N/C-2 7.62,-1.803
LINEAR_TO263-3 = smd 1.067 x 2.159: 1 -2.54,-5.791; 2 0,-5.791; 3 2.54,-5.791 | smd 10.8 x 10.41: TAB 0,2.54
V78-2000-SWITCHING-REGULATOR_V78-2000 = drill 0.8 long: 1 -2.54,0; 2 0,0; 3 2.54,0

### Placement (x,y rotation side)
BLUETOOTH  100.56,25.63 90 top
C1  -23.9,183.11 0 top  (outside the outline)
C2  -27.71,183.11 0 top  (outside the outline)
C3  -31.52,183.11 0 top  (outside the outline)
C4  -35.33,183.11 0 top  (outside the outline)
C5  -39.14,183.11 0 top  (outside the outline)
C6  -42.95,183.11 0 top  (outside the outline)
C7  -46.76,183.11 0 top  (outside the outline)
C8  49.76,190.73 0 top  (outside the outline)
C9  45.95,190.73 0 top  (outside the outline)
C10  42.14,190.73 0 top  (outside the outline)
C11  38.33,190.73 0 top  (outside the outline)
C12  34.52,190.73 0 top  (outside the outline)
C13  30.71,190.73 0 top  (outside the outline)
C14  26.9,190.73 0 top  (outside the outline)
C15  23.09,190.73 0 top  (outside the outline)
C16  19.28,190.73 0 top  (outside the outline)
C17  15.47,190.73 0 top  (outside the outline)
C18  11.66,190.73 0 top  (outside the outline)
C19  7.85,190.73 0 top  (outside the outline)
C20  4.04,190.73 0 top  (outside the outline)
C21  0.23,190.73 0 top  (outside the outline)
C22  -3.58,190.73 0 top  (outside the outline)
C23  -7.39,190.73 0 top  (outside the outline)
C24  -11.2,190.73 0 top  (outside the outline)
C25  -15.01,190.73 0 top  (outside the outline)
C26  -18.82,190.73 0 top  (outside the outline)
C27  -22.63,190.73 0 top  (outside the outline)
C28  -26.44,190.73 0 top  (outside the outline)
C29  -30.25,190.73 0 top  (outside the outline)
C30  -34.06,190.73 0 top  (outside the outline)
C31  -37.87,190.73 0 top  (outside the outline)
C32  -41.68,190.73 0 top  (outside the outline)
C38  18.01,72.62 180 top
C39  38.33,194.54 0 top  (outside the outline)
C48  34.52,194.54 0 top  (outside the outline)
C49  30.71,194.54 0 top  (outside the outline)
C50  26.9,194.54 0 top  (outside the outline)
C51  23.09,194.54 0 top  (outside the outline)
C52  33.25,106.91 90 top
C53  43.41,103.1 0 top
C54  34.52,109.45 180 top
C55  47.22,104.37 270 top
D2  37.06,106.91 180 top
J1  21.82,61.19 180 top
J2  17.76,46.2 90 top
JP1  30.71,31.98 90 top
JP2  18.01,51.54 180 top
JP3  65,7.85 0 top
LOGIC_FUSE  23.09,92.94 90 top
LOGIC_SWITCH  25.63,103.1 0 top
MOTOR_FUSE  19.28,84.05 90 top
MOTOR_SWITCH  37.06,95.48 0 top
OPEN-MV  29.06,68.06 270 top
R1  19.28,194.54 0 top  (outside the outline)
R2  15.47,194.54 0 top  (outside the outline)
R19  -15.01,183.11 0 top  (outside the outline)
R20  -20.09,183.11 0 top  (outside the outline)
TEENSY  104.37,65 0 top
TEENSY1  85.32,65 0 top
TSSP1  65,128 270 top
TSSP2  73.22,127.46 262.5 top
TSSP3  81.31,125.85 255 top
TSSP4  89.11,123.2 247.5 top
TSSP5  96.5,119.56 240 top
TSSP6  103.35,114.98 232.5 top
TSSP7  109.55,109.55 225 top
TSSP8  114.98,103.35 217.5 top
TSSP9  119.56,96.5 210 top
TSSP10  125.85,81.31 195 top
TSSP11  128,65 180 top
TSSP12  125.85,48.69 165 top
TSSP13  119.56,33.5 150 top
TSSP14  109.55,20.45 135 top
TSSP15  96.5,10.44 120 top
TSSP16  81.31,4.15 105 top
TSSP17  65,2 90 top
TSSP18  48.69,4.15 75 top
TSSP19  33.5,10.44 60 top
TSSP20  20.45,20.45 45 top
TSSP21  10.44,33.5 30 top
TSSP22  4.15,48.69 15 top
TSSP23  2,65 0 top
TSSP24  4.15,81.31 345 top
TSSP25  10.44,96.5 330 top
TSSP26  15.02,103.35 322.5 top
TSSP27  20.45,109.55 315 top
TSSP28  26.65,114.98 307.5 top
TSSP29  33.5,119.56 300 top
TSSP30  40.89,123.2 292.5 top
TSSP31  48.69,125.85 285 top
TSSP32  56.78,127.46 277.5 top
U1  57.38,26.9 0 top
U$2  9.12,71.35 270 top
U$5  37.06,68.81 90 bottom
VREG-3.3  43.41,111.99 270 top
VREG-5  37.06,103.1 180 bottom

### Tracks (layer width: path | path; a pad name or v marks a point on that pad's centre or on a via)
3.3V  (42 unrouted)
  Top 1.27: 37.06,111.99 37.06,110.97 36.93,110.85 35.79,111.99 | 35.79,111.99 35.54,112.24 35.54,112.4 37.21,112.4 VREG-3.3.2 37.62,112.45 38.33,113.16 38.43,113.16 39.6,111.99 38.43,110.82 38.33,110.82 38.23,110.92 38.13,110.92 37.06,111.99 | 35.79,111.99 37.06,111.99 | VREG-3.3.TAB 45.95,117.07 46.59,117.7 51.03,117.7 51.28,117.45 51.28,106.78 50.9,106.4 40.87,106.4 40.74,106.53 40.74,117.32 40.62,117.45 43.09,119.93 45.44,117.58 43.86,115.99 43.35,115.99 41.63,117.7 42.33,118.4 43.09,118.4 44.05,117.45 43.47,116.88 43.22,116.88 42.39,117.7 41.95,117.26 41.95,115.99 VREG-3.3.TAB
  pour Top: -8.66,73.89 -8.66,39.6 30.71,0.23 34.52,-3.58 85.32,-3.58 94.21,-3.58 131.04,33.25 143.74,45.95 143.74,157.71 -9.93,157.71 -9.93,75.16
5V
  Top 0.61: C53.1 VREG-5.3
  Top 1.27: D2.A 36.87,105.46 38.33,105.46 39.6,104.19 VREG-5.3
+3V3  (1 unrouted)
BATTERY-VOLTAGE(ANALOG)  (1 unrouted)
D+1
  Top 0.406: J2.D+1 17.76,51.28 JP2.3
D-1  (via drill 0.51)
  Top 0.406: J2.D-1 17.11,47.64 16.82,47.36 16.34,47.36 16.1,47.12 16.1,46.64 v15.8,46.33
  Bottom 0.406: v15.8,46.33 14.97,47.15 14.97,51.04 JP2.4
GND  (via drill 0.51)  (45 unrouted)
  Top 0.61: C54.2 33.25,109.08 C52.2 32.88,108.18 v31.98,108.18 | C53.2 45.18,103.47 C55.2
  Top 1.016: v9.12,77.06 7.22,75.16 U$2.4
  Top 1.27: VREG-3.3.1 v34.52,114.53
  Bottom 2.54: 37.06,101.83 VREG-5.2 37.06,105.64 | C38.- 20.55,72.66 20.55,73.89
  pour Bottom: 66.27,136.12 40.87,136.12 -4.85,90.4 -4.85,-25.17 -6.12,-26.44 153.9,-26.44 153.9,73.89 98.02,129.77 91.67,136.12
ID1  (via drill 0.51)
  Top 0.406: J2.ID1 18.45,48.86 18.45,48.04 18.69,47.8 19.02,47.8 19.72,47.09 v19.72,45.7
  Bottom 0.406: v19.72,45.7 19.72,46.26 20.8,47.35 20.8,51.28 JP2.2
N$1
  Top 5.08: 14.66,64.97 U$2.8 U$2.7 U$2.6 U$2.5
  Top 6.35: J1.2 14.66,64.97
N$2
  Top 3.81: MOTOR_SWITCH.1 35.08,90.96 | MOTOR_FUSE.P$2 23.55,82.78 26.9,82.78
  Top 5.08: 24.36,82.78 26.9,82.78 35.08,90.96
N$3  (1 unrouted)
  Top 0.762: U$2.3 U$2.2
  Top 3.302: U$2.2 U$2.1
  Top 3.81: LOGIC_FUSE.P$1 18.47,94.67 18.01,94.21 | MOTOR_FUSE.P$1 14.2,87.05 14.2,90.4
  Top 5.08: U$2.1 14.04,74.09 | 14.04,74.09 C38.+ | 14.04,74.09 14.2,74.26 14.2,90.4 18.01,94.21
N$4
  Top 2.54: 25.63,96.75 26.9,95.48 LOGIC_FUSE.P$2
  Top 3.81: LOGIC_SWITCH.1 23.65,98.73 25.63,96.75
N$40
  Top 0.61: C52.1 34.52,104.74 VREG-5.1
  Top 2.54: LOGIC_SWITCH.2 VREG-5.1
N$41
  Top 0.61: VREG-3.3.3 C54.1
  Top 1.27: D2.C 37.62,107.99 VREG-3.3.3
OPENMV-VOL
  Top 0.406: JP2.5 15.18,49.29 16.22,49.29 16.5,49.01 16.46,48.97 J2.VBUS1
SCL(IMU)  (1 unrouted)
SDA(IMU)  (1 unrouted)
TSSP19  (3 unrouted)
  Top 0.305: TSSP19.3 35.84,9.17 39.6,12.93 39.6,16.74
TSSP20  (6 unrouted)
  Top 0.305: TSSP20.3 24.27,18.66 27.96,14.96 34.73,14.96 36.89,17.12 39.26,17.12
TSSP21  (6 unrouted)
  Top 0.305: TSSP21.3 17.38,25.63 18.01,25.63 28.17,15.47 34.52,15.47 36.68,17.63 39.05,17.63
TSSP22  (6 unrouted)
  Top 0.305: TSSP22.3 4.8,43.92 6.58,42.14 6.58,39.6 7.85,38.33 9.12,38.33 11.66,35.79 11.66,34.52 18.01,28.17 18.01,26.35 28.38,15.98 34.31,15.98 36.47,18.14 38.84,18.14
TSSP23  (6 unrouted)
  Top 0.305: TSSP23.3 4.04,60.42 4.04,53.57 5.31,52.3 5.31,49.76 6.58,48.49 6.58,42.86 7.09,42.35 7.09,39.81 8.06,38.84 9.33,38.84 12.17,36 12.17,34.73 18.52,28.38 18.52,26.56 28.59,16.49 34.1,16.49 36.26,18.65 38.63,18.65
TSSP24  (6 unrouted)
  Top 0.305: TSSP24.3 3.49,61.69 4.55,60.63 4.55,53.78 5.82,52.51 5.82,49.97 7.09,48.7 7.09,43.07 7.6,42.56 7.6,40.02 8.27,39.35 9.54,39.35 12.68,36.21 12.68,34.94 19.03,28.59 19.03,26.77 28.8,16.99 33.89,16.99 36.05,19.15 38.42,19.15
TSSP25  (6 unrouted)
  Top 0.305: TSSP25.3 9.17,92.99 6.58,90.4 6.58,80.24 5.31,78.97 5.31,77.32 4,76.01 4,61.9 9.79,56.11 25.63,56.11 28.17,53.57 28.17,18.34 29.01,17.5 33.68,17.5 35.84,19.66 38.21,19.66
TSSP26  (via drill 0.51)  (6 unrouted)
  Top 0.305: TSSP26.3 13.47,98.56 12.93,98.02 12.93,96.75 11.66,95.48 11.66,94.21 7.09,89.64 7.09,80.03 5.82,78.76 5.82,77.11 4.51,75.8 4.51,71.21 v4.86,70.85 | v4.86,66.36 4.51,66.01 4.51,62.11 10,56.62 25.84,56.62 28.68,53.78 28.68,18.55 29.22,18.01 33.47,18.01 35.63,20.17 38,20.17
  Bottom 0.305: v4.86,70.85 v4.86,66.36
TSSP27  (via drill 0.51)  (3 unrouted)
  Top 0.305: TSSP27.3 18.66,105.02 16.74,103.1 16.74,101.83 13.98,99.07 13.98,98.35 13.44,97.81 13.44,96.54 12.17,95.27 12.17,94 7.6,89.43 7.6,79.82 6.33,78.55 6.33,76.9 5.01,75.59 5.01,72.42 v5.37,72.07 | v5.37,65.15 5.01,64.79 5.01,62.32 10.21,57.13 26.05,57.13 29.19,53.99 29.19,47.47 30.71,45.95 31.98,45.95 33.25,44.68 33.25,43.41 40.87,35.79
  Bottom 0.305: v5.37,72.07 5.37,71.56 5.72,71.21 5.72,70.49 5.37,70.14 5.37,67.08 5.72,66.72 5.72,66 5.37,65.65 v5.37,65.15
TSSP28  (via drill 0.51)  (2 unrouted)
  Top 0.305: TSSP28.3 24.63,110.99 19.16,105.52 19.16,104.81 17.25,102.89 17.25,101.62 14.49,98.86 14.49,98.14 13.95,97.6 13.95,96.33 12.68,95.06 12.68,93.79 8.1,89.22 8.1,79.61 6.83,78.34 6.83,76.69 5.52,75.38 5.52,73.64 v5.88,73.28 | 47.22,37.06 47.22,44.68 49.76,47.22 49.76,49.76 48.49,51.03 v30.71,51.03
  Bottom 0.305: v5.88,73.28 5.88,72.78 6.23,72.42 6.23,70.28 5.88,69.93 5.88,67.29 6.23,66.93 6.23,59 9.5,55.73 26.01,55.73 v30.71,51.03
TSSP29  (via drill 0.51)  (2 unrouted)
  Top 0.305: TSSP29.3 31.3,116.94 19.67,105.31 19.67,104.59 17.76,102.68 17.76,101.41 15,98.65 15,97.93 14.45,97.39 14.45,96.12 13.18,94.85 13.18,93.58 8.61,89.01 8.61,79.4 7.34,78.13 7.34,77.72 v7.7,77.37 | v30.71,52.25 31.42,51.54 48.7,51.54 50.27,49.97 50.27,47.01 47.73,44.47 47.73,37.23
  Bottom 0.305: v7.7,77.37 6.83,76.5 6.83,70.17 6.38,69.72 6.38,67.5 6.74,67.14 6.74,59.21 9.71,56.24 26.22,56.24 30.21,52.25 v30.71,52.25
TSSP30  (via drill 0.51)  (1 unrouted)
  Top 0.305: TSSP30.3 38.54,121.09 35.79,118.34 34.52,118.34 31.98,115.8 30.88,115.8 20.18,105.1 20.18,104.38 18.26,102.47 18.26,101.2 15.5,98.44 15.5,96.3 v15.32,96.11
USBGND
  Top 0.406: J2.GND1 19.06,49.05 19.51,49.51 20.55,49.51 21.06,49.51 21.57,49.51 23.09,51.03 JP2.1